# EAGLE design Si7006 Breakout Board (EAGLE 7.1.0)
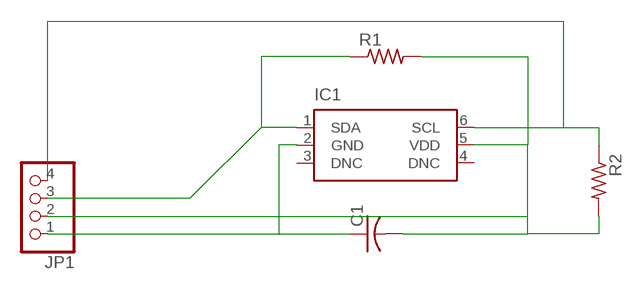
[diagram p0: schematic, sheet 1]

## Parts
C1  C-USC0805  [C0805]
IC1  SI7006-A10-IM  [DFN6-3X3]
JP1  PINHD-1X4  [1X04]
R1  R-US_R0805  [R0805]
R2  R-US_R0805  [R0805]

## Nets
N$1: C1.1 IC1.2(GND) JP1.1
N$2: C1.2 IC1.5(VDD) JP1.2 R1.2 R2.2
N$3: IC1.1(SDA) JP1.3 R1.1
N$5: IC1.6(SCL) JP1.4 R2.1
Unconnected: IC1.3(DNC) IC1.4(DNC)

## Library data of the parts
C1 = resistor:C-US: CAPACITOR, American symbol
IC1 = si70xx-10:SI7006-*: I2C Humidity and Temperature Sensor Source: http://www.silabs.com/Support%20Documents/TechnicalDocs/Si7006-A10.pdf; MF: Silicon Labs; MPN: Si7006-A10-IM; OC_FARNELL: unknown; OC_NEWARK: unknown
JP1 = pinhead:PINHD-1X4: PIN HEADER
R1 R2 = resistor:R-US_: RESISTOR, American symbol

## Board
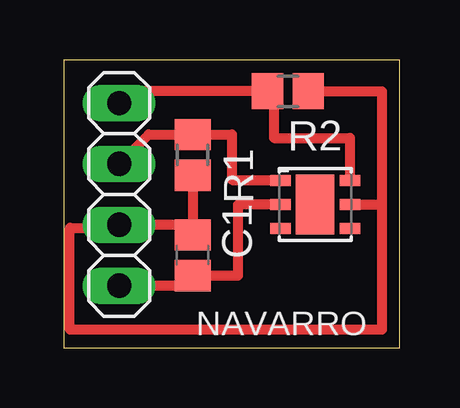
[diagram p1: board, top side]

Size 14 x 12 mm. Coordinates in mm from the lower left corner, seen from the top.
Outline: 0,0 14,0 14,12 0,12 0,0
Copper layers (1*16): Top 0.035mm / dielectric 1.5mm / Bottom 0.035mm
Design rules "default": minimum track width 10mil, minimum drill 24mil, track to track 8mil, track to pad 8mil, pad to pad 8mil, via to via 8mil, smd to smd 8mil, copper to edge 40mil, drill to drill 8mil, minimum pad ring 10mil, minimum via ring 8mil, stop-mask expansion 4mil, vias tented up to drill 0mil, thermal gap 10mil

### Footprints (pad centres in the part's own frame; a part is rotated, then mirrored left to right if it is on the bottom)
C0805 = smd 1.3 x 1.5: 1 -0.85,0; 2 0.85,0
DFN6-3X3 = smd 0.85 x 0.45: 1 -1.45,1; 2 -1.45,0; 3 -1.45,-1; 4 1.45,-1; 5 1.45,0; 6 1.45,1 | smd 1.6 x 2.5: EXP 0,0
1X04 = drill 1.016 long: 1 -3.81,0; 2 -1.27,0; 3 1.27,0; 4 3.81,0
R0805 = smd 1.3 x 1.5: 1 -0.85,0; 2 0.85,0

### Placement (x,y rotation side)
C1  5.37,3.85 90 top
IC1  10.47,5.96 0 top
JP1  2.31,6.39 90 top
R1  5.37,8.04 270 top
R2  9.34,10.7 0 top

### Tracks (layer width: path | path; a pad name or v marks a point on that pad's centre or on a via)
N$1
  Top 0.406: JP1.1 4.95,2.58 arc90 C1.1 7.25,3 7.25,5.96 IC1.2
N$2
  Top 0.406: R1.2 C1.2 arc90 4.95,5.12 JP1.2 2.31,5 0.25,5 0.25,0.75 13.25,0.75 13.25,5.96 | R2.2 13.25,10.7 13.25,5.96 | IC1.5 13.25,5.96
N$3
  Top 0.406: JP1.3 3.54,8.89 R1.1 7,8.89 7,7 9.02,7 IC1.1
N$5
  Top 0.406: IC1.6 11.92,8.75 8.75,8.75 8.75,10.7 R2.1 2.81,10.7 JP1.4

### Text on the board
tNames: NAVARRO